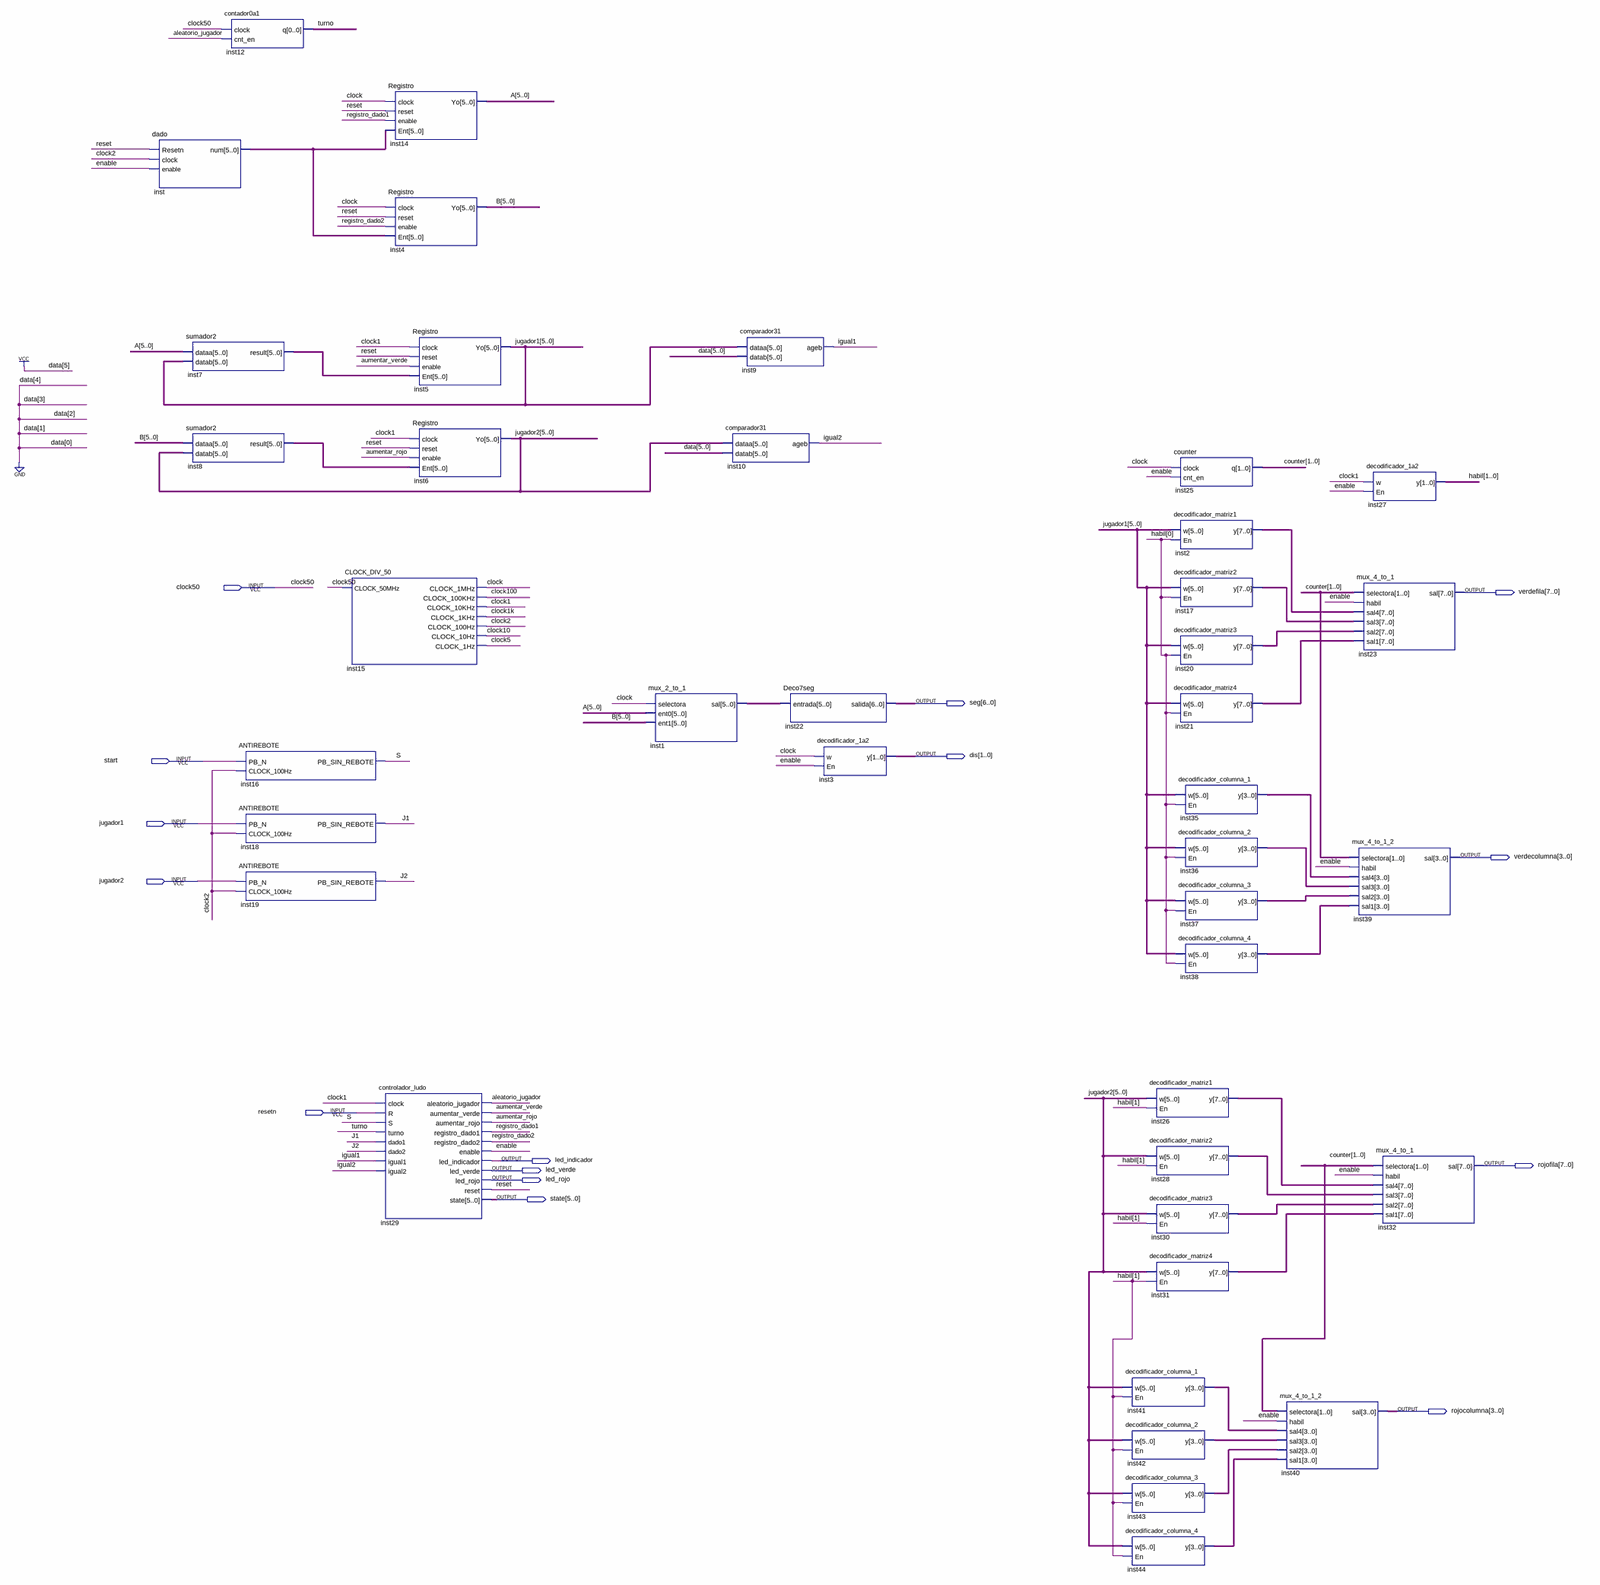
[diagram p0: schematic sheet, whole]
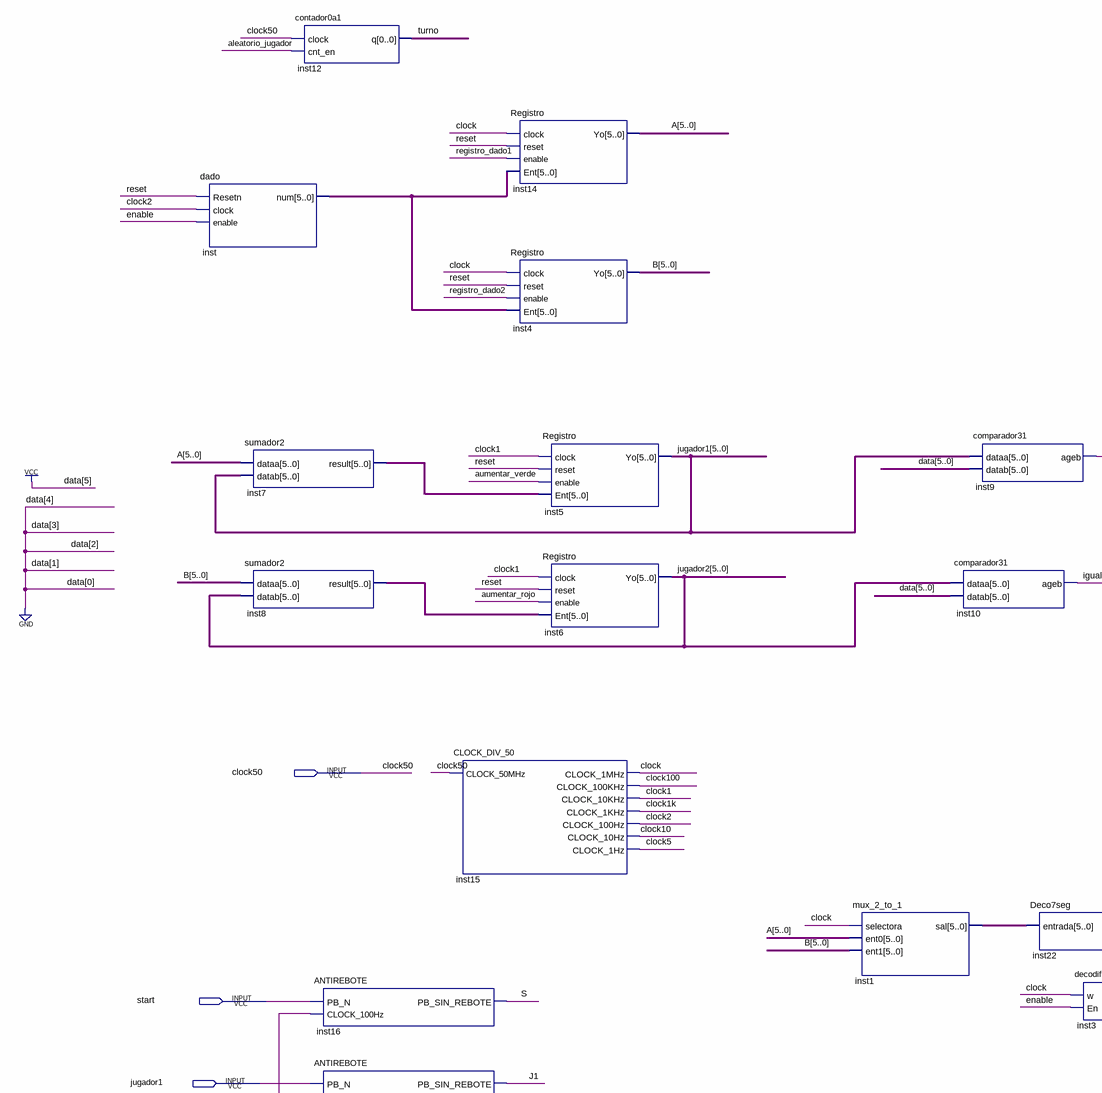
[diagram p1: schematic sheet, upper left part]
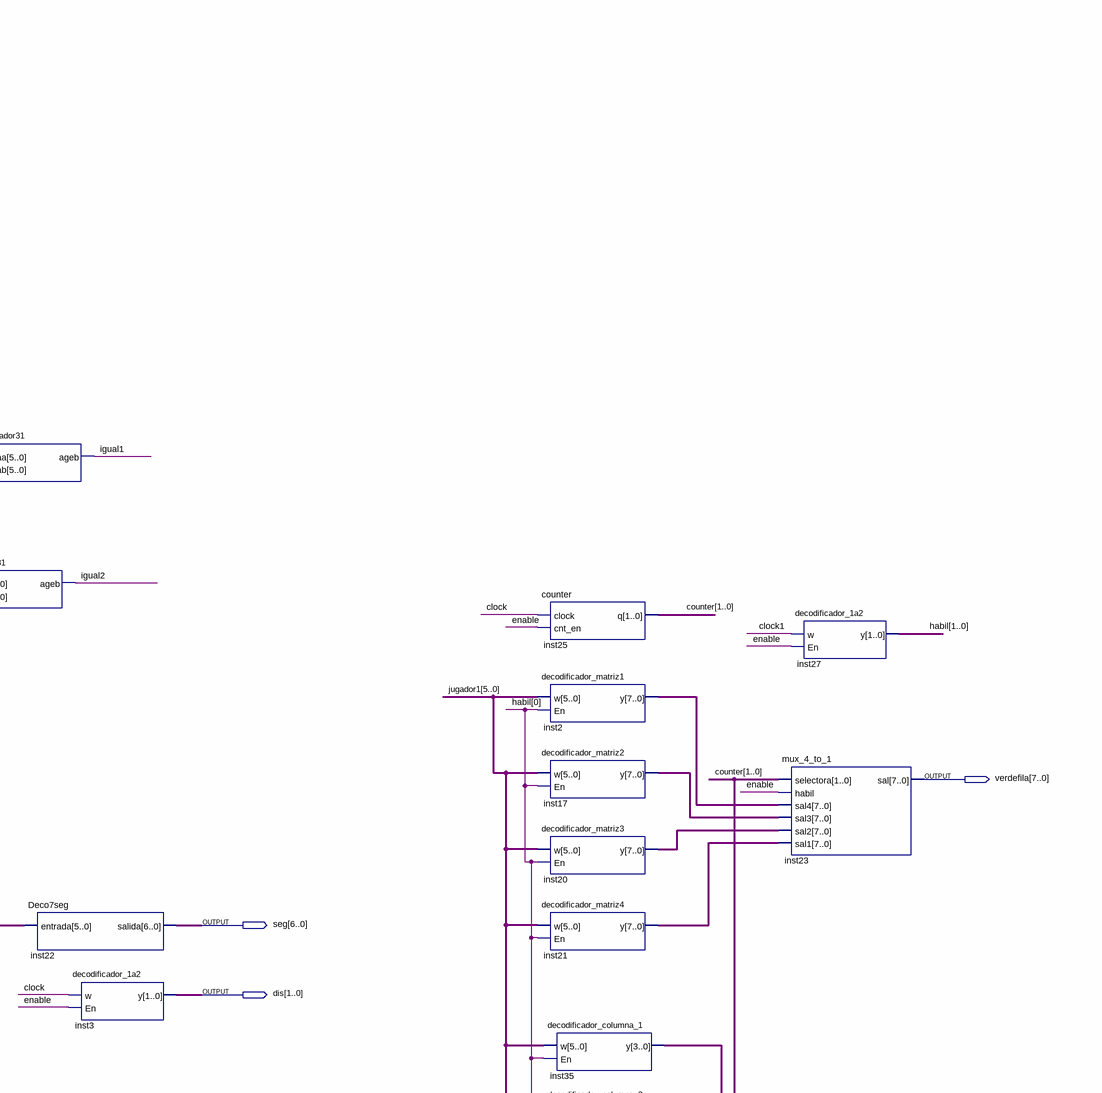
[diagram p2: schematic sheet, upper right part]
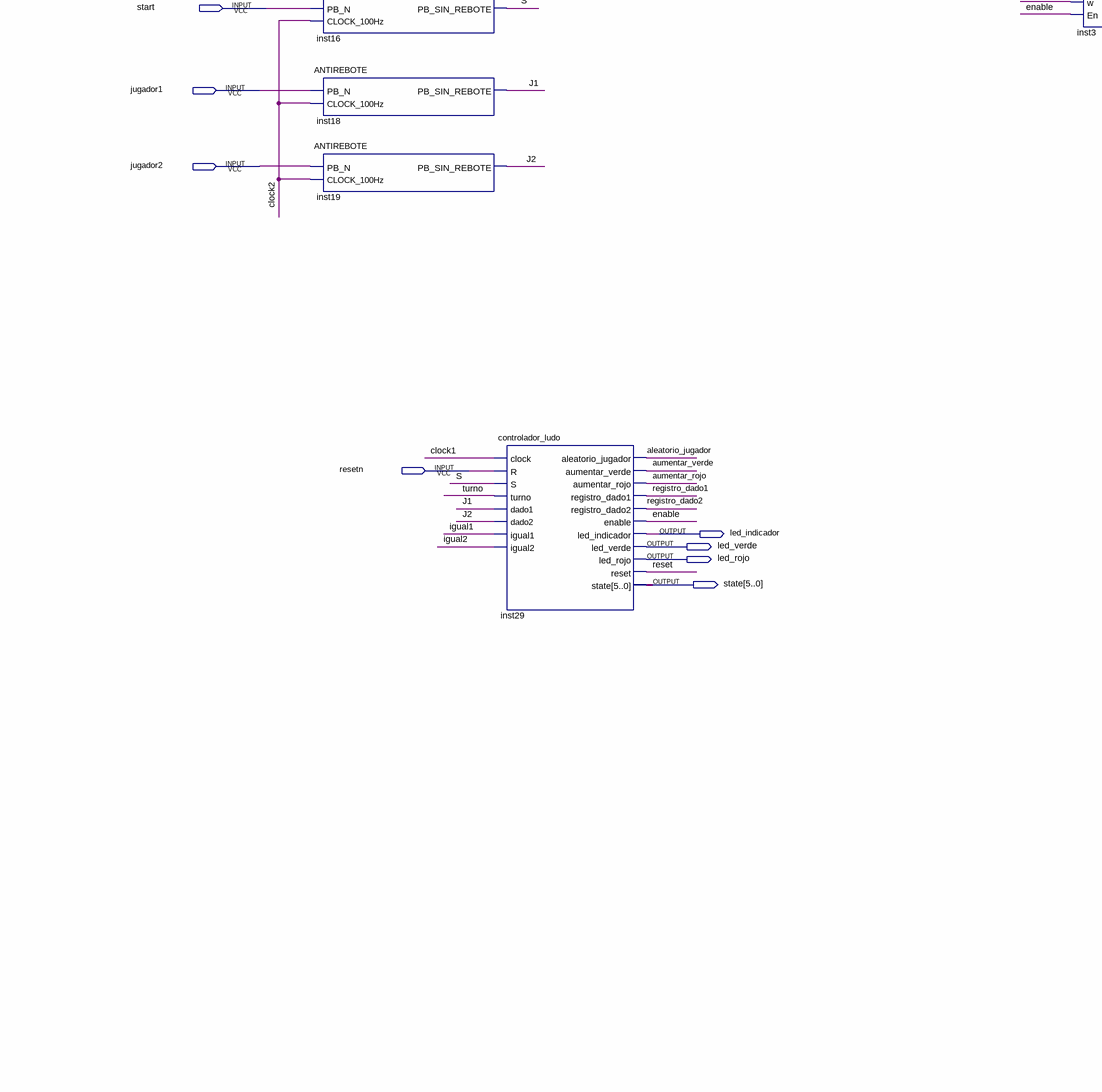
[diagram p3: schematic sheet, lower left part]
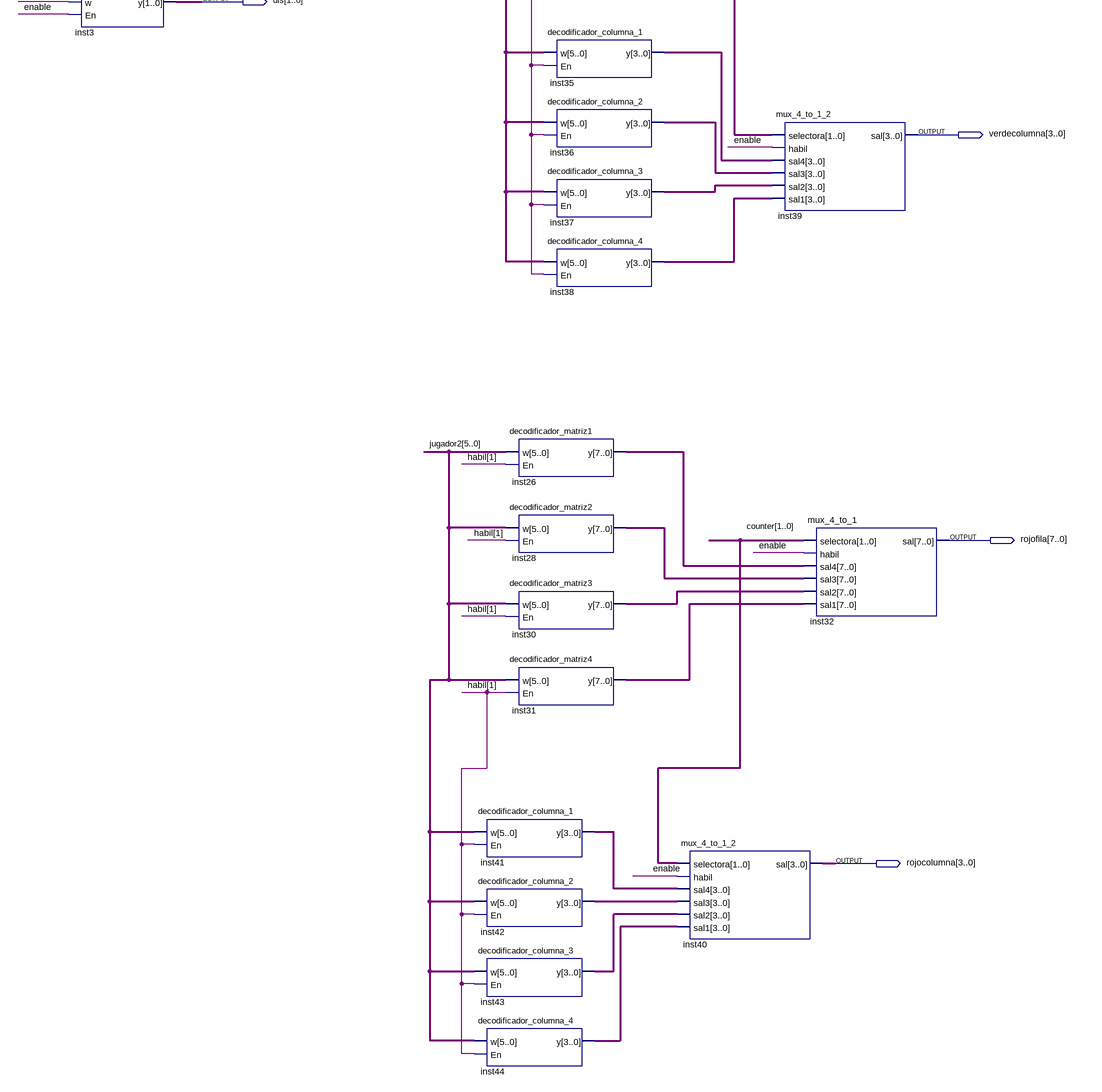
[diagram p4: schematic sheet, lower right part]
// Quartus schematic block1.bdf as structural Verilog: 40 symbols, 15 pins
module block1 (
  input  clock50,
  input  start,
  input  jugador1,
  input  jugador2,
  input  resetn,
  output [7:0] verdefila,
  output [6:0] seg,
  output [1:0] dis,
  output [3:0] verdecolumna,
  output led_indicador,
  output [7:0] rojofila,
  output led_verde,
  output led_rojo,
  output [5:0] state,
  output [3:0] rojocolumna
);

  wire aleatorio_jugador, aumentar_rojo, aumentar_verde, clock, clock1, clock1k, clock2, clock5, clock10,
       clock100, enable, igual1, igual2, J1, J2, registro_dado1, registro_dado2, reset, S, turno;
  wire [1:0] counter, habil;
  wire [3:0] inst35_y, inst36_y, inst37_y, inst38_y, inst41_y, inst42_y, inst43_y, inst44_y;
  wire [5:0] A, B, inst1_sal, inst7_result, inst8_result, inst_num, jugador1_bus, jugador2_bus;
  wire [7:0] inst2_y, inst17_y, inst20_y, inst21_y, inst26_y, inst28_y, inst30_y, inst31_y;

  dado inst (.Resetn(reset), .clock(clock2), .enable(enable), .num(inst_num));
  sumador2 inst7 (.dataa(A), .datab(jugador1_bus), .result(inst7_result));
  sumador2 inst8 (.dataa(B), .datab(jugador2_bus), .result(inst8_result));
  contador0a1 inst12 (.clock(clock50), .cnt_en(aleatorio_jugador), .q(turno));
  ANTIREBOTE inst16 (.PB_N(start), .CLOCK_100Hz(clock2), .PB_SIN_REBOTE(S));
  ANTIREBOTE inst18 (.PB_N(jugador1), .CLOCK_100Hz(clock2), .PB_SIN_REBOTE(J1));
  ANTIREBOTE inst19 (.PB_N(jugador2), .CLOCK_100Hz(clock2), .PB_SIN_REBOTE(J2));
  CLOCK_DIV_50 inst15 (
    .CLOCK_50MHz(clock50), .CLOCK_1MHz(clock), .CLOCK_100KHz(clock100), .CLOCK_10KHz(clock1),
    .CLOCK_1KHz(clock1k), .CLOCK_100Hz(clock2), .CLOCK_10Hz(clock10), .CLOCK_1Hz(clock5));
  controlador_ludo inst29 (
    .clock(clock1), .R(resetn), .S(S), .turno(turno), .dado1(J1), .dado2(J2), .igual1(igual1),
    .igual2(igual2), .aleatorio_jugador(aleatorio_jugador), .aumentar_verde(aumentar_verde),
    .aumentar_rojo(aumentar_rojo), .registro_dado1(registro_dado1), .registro_dado2(registro_dado2),
    .enable(enable), .led_indicador(led_indicador), .led_verde(led_verde), .led_rojo(led_rojo),
    .reset(reset), .state(state));
  Registro inst14 (.clock(clock), .reset(reset), .enable(registro_dado1), .Ent(inst_num), .Yo(A));
  Registro inst4 (.clock(clock), .reset(reset), .enable(registro_dado2), .Ent(inst_num), .Yo(B));
  Registro inst5 (.clock(clock1), .reset(reset), .enable(aumentar_verde), .Ent(inst7_result), .Yo(jugador1_bus));
  Registro inst6 (.clock(clock1), .reset(reset), .enable(aumentar_rojo), .Ent(inst8_result), .Yo(jugador2_bus));
  mux_2_to_1 inst1 (.selectora(clock), .ent0(A), .ent1(B), .sal(inst1_sal));
  comparador31 inst10 (.dataa(jugador2_bus), .datab(6'b100000), .ageb(igual2));
  comparador31 inst9 (.dataa(jugador1_bus), .datab(6'b100000), .ageb(igual1));
  Deco7seg inst22 (.entrada(inst1_sal), .salida(seg));
  decodificador_1a2 inst3 (.w(clock), .En(enable), .y(dis));
  decodificador_matriz1 inst26 (.w(jugador2_bus), .En(habil[1]), .y(inst26_y));
  decodificador_matriz2 inst28 (.w(jugador2_bus), .En(habil[1]), .y(inst28_y));
  decodificador_matriz3 inst30 (.w(jugador2_bus), .En(habil[1]), .y(inst30_y));
  decodificador_matriz4 inst31 (.w(jugador2_bus), .En(habil[1]), .y(inst31_y));
  decodificador_columna_1 inst41 (.w(jugador2_bus), .En(habil[1]), .y(inst41_y));
  decodificador_columna_2 inst42 (.w(jugador2_bus), .En(habil[1]), .y(inst42_y));
  decodificador_columna_3 inst43 (.w(jugador2_bus), .En(habil[1]), .y(inst43_y));
  decodificador_columna_4 inst44 (.w(jugador2_bus), .En(habil[1]), .y(inst44_y));
  counter inst25 (.clock(clock), .cnt_en(enable), .q(counter));
  decodificador_matriz1 inst2 (.w(jugador1_bus), .En(habil[0]), .y(inst2_y));
  decodificador_matriz2 inst17 (.w(jugador1_bus), .En(habil[0]), .y(inst17_y));
  decodificador_matriz3 inst20 (.w(jugador1_bus), .En(habil[0]), .y(inst20_y));
  decodificador_matriz4 inst21 (.w(jugador1_bus), .En(habil[0]), .y(inst21_y));
  decodificador_columna_1 inst35 (.w(jugador1_bus), .En(habil[0]), .y(inst35_y));
  decodificador_columna_2 inst36 (.w(jugador1_bus), .En(habil[0]), .y(inst36_y));
  decodificador_columna_3 inst37 (.w(jugador1_bus), .En(habil[0]), .y(inst37_y));
  decodificador_columna_4 inst38 (.w(jugador1_bus), .En(habil[0]), .y(inst38_y));
  mux_4_to_1_2 inst40 (
    .selectora(counter), .habil(enable), .sal4(inst41_y), .sal3(inst42_y), .sal2(inst43_y), .sal1(inst44_y),
    .sal(rojocolumna));
  decodificador_1a2 inst27 (.w(clock1), .En(enable), .y(habil));
  mux_4_to_1 inst23 (
    .selectora(counter), .habil(enable), .sal4(inst2_y), .sal3(inst17_y), .sal2(inst20_y), .sal1(inst21_y),
    .sal(verdefila));
  mux_4_to_1_2 inst39 (
    .selectora(counter), .habil(enable), .sal4(inst35_y), .sal3(inst36_y), .sal2(inst37_y), .sal1(inst38_y),
    .sal(verdecolumna));
  mux_4_to_1 inst32 (
    .selectora(counter), .habil(enable), .sal4(inst26_y), .sal3(inst28_y), .sal2(inst30_y), .sal1(inst31_y),
    .sal(rojofila));
endmodule
